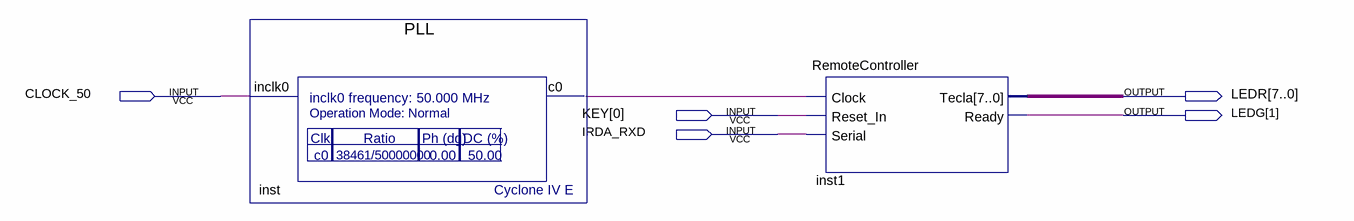
[diagram p0: schematic sheet]
// Quartus schematic Controle.bdf as structural Verilog: 2 symbols, 5 pins
module Controle (
  input  CLOCK_50,
  input  [0:0] KEY,
  input  IRDA_RXD,
  output [7:0] LEDR,
  output [1:1] LEDG
);

  wire inst_c0;

  PLL inst (.inclk0(CLOCK_50), .c0(inst_c0));
  RemoteController inst1 (.Clock(inst_c0), .Reset_In(KEY[0]), .Serial(IRDA_RXD), .Tecla(LEDR), .Ready(LEDG[1]));
endmodule
